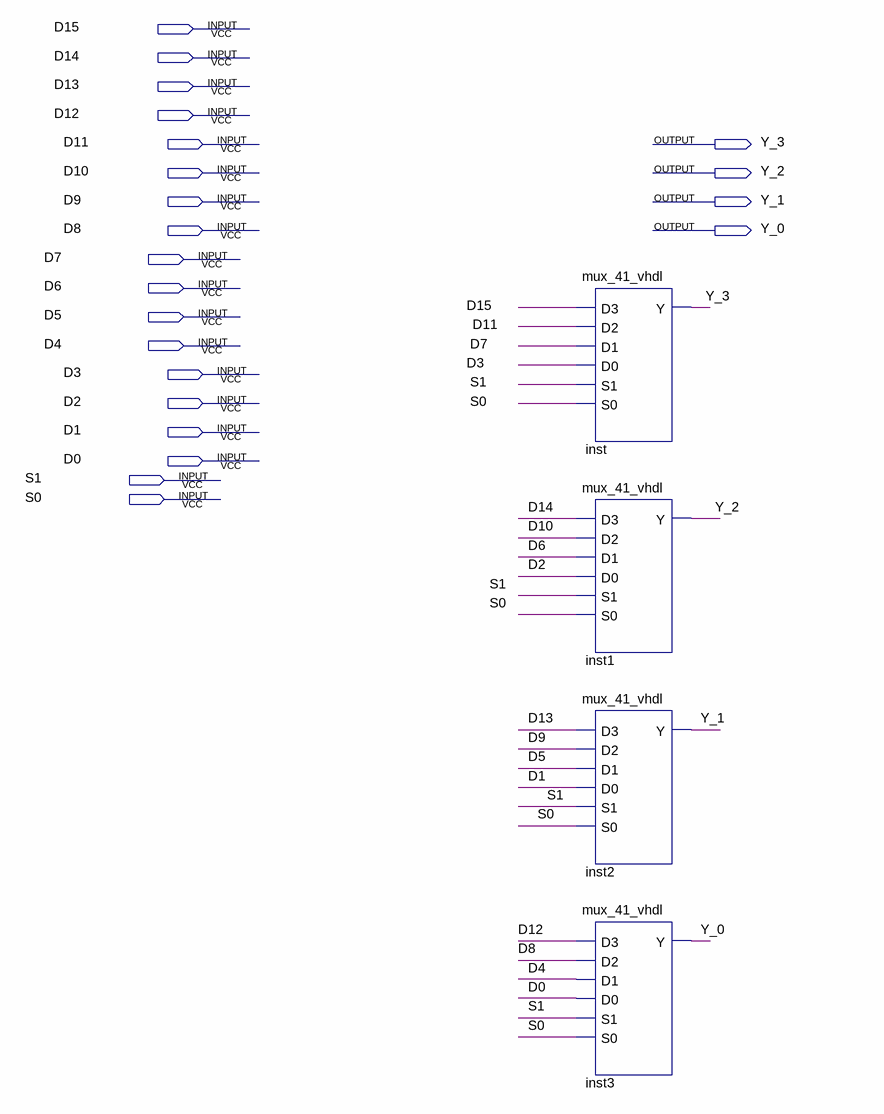
[diagram p0: schematic sheet]
// Quartus schematic reg_mux_v2.bdf as structural Verilog: 4 symbols, 22 pins
module reg_mux_v2 (
  input  D15,
  input  D14,
  input  D13,
  input  D12,
  input  D11,
  input  D10,
  input  D9,
  input  D8,
  input  D7,
  input  D6,
  input  D5,
  input  D4,
  input  D3,
  input  D2,
  input  D1,
  input  D0,
  input  S1,
  input  S0,
  output Y_3,
  output Y_2,
  output Y_1,
  output Y_0
);

  mux_41_vhdl inst (.D3(D15), .D2(D11), .D1(D7), .D0(D3), .S1(S1), .S0(S0), .Y(Y_3));
  mux_41_vhdl inst1 (.D3(D14), .D2(D10), .D1(D6), .D0(D2), .S1(S1), .S0(S0), .Y(Y_2));
  mux_41_vhdl inst2 (.D3(D13), .D2(D9), .D1(D5), .D0(D1), .S1(S1), .S0(S0), .Y(Y_1));
  mux_41_vhdl inst3 (.D3(D12), .D2(D8), .D1(D4), .D0(D0), .S1(S1), .S0(S0), .Y(Y_0));
endmodule
